# EAGLE design ch552_3key_keyboard (EAGLE 9.6.2)
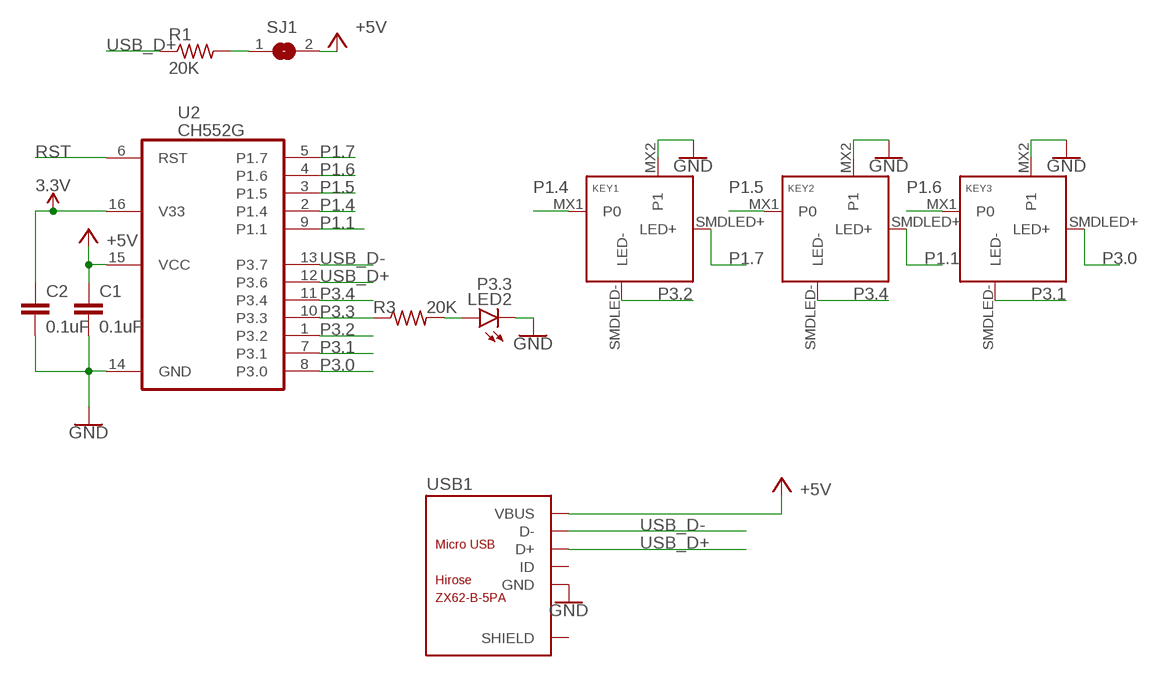
[diagram p0: schematic, sheet 1]

## Parts
C1  0.1uF  C-EUC0805K  [C0805K]
C2  0.1uF  C-EUC0805K  [C0805K]
KEY1  KEYSWITCH-SMDLED-MXHSPCB-1U-SMDLED  [MXHSPCB-1U-SMDLED]
KEY2  KEYSWITCH-SMDLED-MXHSPCB-1U-SMDLED  [MXHSPCB-1U-SMDLED]
KEY3  KEYSWITCH-SMDLED-MXHSPCB-1U-SMDLED  [MXHSPCB-1U-SMDLED]
LED2  P3.3  GHI-BASICCOMPONENTS_LED-(INCH)-0805  [GHI-BASICCOMPONENTS_0805-LED]
R1  20K  R-US_R0805  [R0805]
R3  20K  R-US_R0805  [R0805]
SJ1  SJ  [SJ]
U2  CH552G  MY_IC_CH551G_CH552GSOP-16  [MY_IC_SO16]
USB1  ZX62-B-5PA  MICRO-USB-SMD(ZX62-B-5PA)  [MICRO-USB5+6P-SMD-0.65-AB]

## Nets
3.3V: C2.1 U2.16(V33)
+5V: C1.1 SJ1.2 U2.15(VCC) USB1.1(VBUS)
GND: C1.2 C2.2 KEY1.MX2(P1) KEY2.MX2(P1) KEY3.MX2(P1) LED2.K U2.14(GND) USB1.5(GND)
N$1: R1.2 SJ1.1
N$2: LED2.A R3.2
P1.1: KEY2.SMDLED+(LED+) U2.9(P1.1)
P1.4: KEY1.MX1(P0) U2.2(P1.4)
P1.5: KEY2.MX1(P0) U2.3(P1.5)
P1.6: KEY3.MX1(P0) U2.4(P1.6)
P1.7: KEY1.SMDLED+(LED+) U2.5(P1.7)
P3.0: KEY3.SMDLED+(LED+) U2.8(P3.0)
P3.1: KEY3.SMDLED-(LED-) U2.7(P3.1)
P3.2: KEY1.SMDLED-(LED-) U2.1(P3.2)
P3.3: R3.1 U2.10(P3.3)
P3.4: KEY2.SMDLED-(LED-) U2.11(P3.4)
RST: U2.6(RST)
USB_D+: R1.1 U2.12(P3.6) USB1.3(D+)
USB_D-: U2.13(P3.7) USB1.2(D-)
Unconnected: USB1.4(ID) USB1.P1(SHIELD) USB1.P2(SHIELD) USB1.P3(SHIELD) USB1.P4(SHIELD) USB1.P5(SHIELD) USB1.P6(SHIELD)

## Library data of the parts
C1 C2 = rcl:C-EU: CAPACITOR, European symbol; LCSC: C16834; SPICEPREFIX: C
KEY1-KEY3 = Keyboard:KEYSWITCH-SMDLED
LED2 = BeagleBone_Black_Wireless:GHI-BASICCOMPONENTS_LED-(INCH)-
R1 R3 = rcl:R-US_: RESISTOR, American symbol; SPICEPREFIX: R
SJ1 = jumper:SJ: SMD solder JUMPER
U2 = myOwnLib:MY_IC_CH551G_CH552G; LCSC: C111292
USB1 = microusbConnector:MICRO-USB-SMD(ZX62-B-5PA): 320010005; LCSC: C10418; MPN: ZX62-B-5PA

## Board
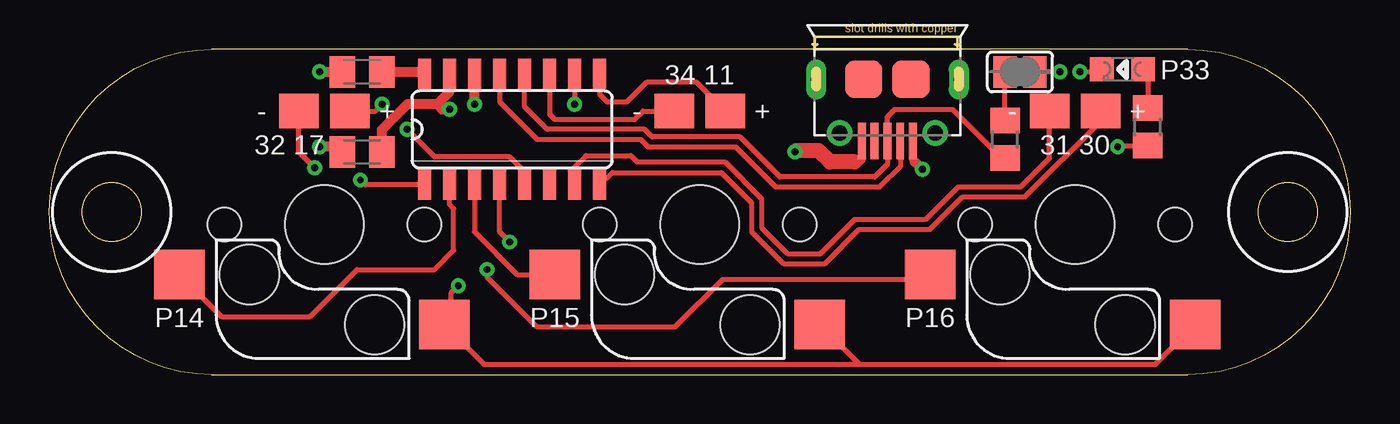
[diagram p1: board, top side]
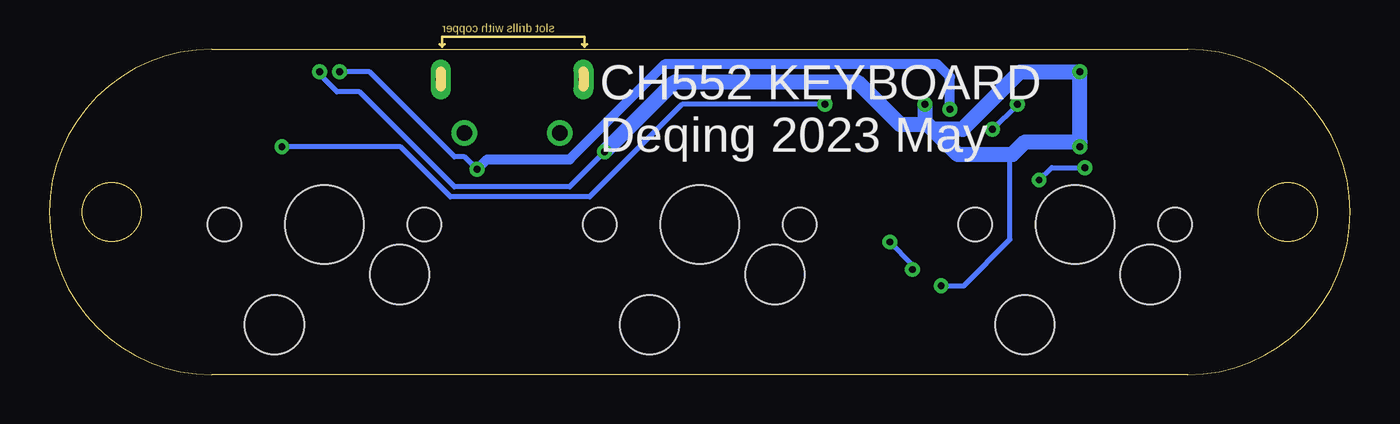
[diagram p2: board, bottom side, seen from below]

Size 66.04 x 16.51 mm. Coordinates in mm from the lower left corner, seen from the top.
Outline: 8.26,0 57.78,0 arc180 57.78,16.51 8.26,16.51 arc180 8.26,0
Outline: circle at 3.17,8.26 radius 1.5
Outline: circle at 62.87,8.26 radius 1.5
Copper layers (1*16): Top 0.035mm / dielectric 1.5mm / Bottom 0.035mm
Design rules "eagleRules10Mil *": minimum track width 10mil, minimum drill 0.3mm, track to track 10mil, track to pad 10mil, pad to pad 10mil, via to via 10mil, smd to smd 10mil, copper to edge 15mil, drill to drill 15mil, minimum pad ring 10mil, minimum via ring 8mil, stop-mask expansion 4mil, vias tented up to drill 14mil, thermal gap 10mil

### Footprints (pad centres in the part's own frame; a part is rotated, then mirrored left to right if it is on the bottom)
C0805K = smd 1.3 x 1.6: 1 -1,0; 2 1,0
MXHSPCB-1U-SMDLED = smd 2.55 x 2.5: MX1 7.36,2.54; MX2 -6.09,5.08 | smd 2 x 1.75: SMDLED+ -1.3,-5.75; SMDLED- 1.3,-5.75 | hole 4: 0,0 | hole 1.7: 5.08,0; -5.08,0 | hole 3: 3.81,2.54; -2.54,5.08
GHI-BASICCOMPONENTS_0805-LED = smd 1.2 x 1.2: A 0,1.05; K 0,-1.05
R0805 = smd 1.3 x 1.5: 1 -0.95,0; 2 0.95,0
SJ = smd 1.168 x 1.6: 1 -0.762,0; 2 0.762,0
MY_IC_SO16 = smd 0.66 x 1.524: 1 -4.445,-2.819; 2 -3.175,-2.819; 3 -1.905,-2.819; 4 -0.635,-2.819; 5 0.635,-2.819; 6 1.905,-2.819; 7 3.175,-2.819; 8 4.445,-2.819; 9 4.445,2.819; 10 3.175,2.819; 11 1.905,2.819; 12 0.635,2.819; 13 -0.635,2.819; 14 -1.905,2.819; 15 -3.175,2.819; 16 -4.445,2.819
MICRO-USB5+6P-SMD-0.65-AB = smd 0.4 x 1.858: 1 -1.3,3.129; 2 -0.65,3.129; 3 0,3.129; 4 0.65,3.129; 5 1.3,3.129 | smd 1.9 x 1.9: P1 -1.2,0; P2 1.2,0 | drill 0.508 pad 1.016 long: P3 -3.625,0; P4 3.625,0 | drill 0.8: P5 -2.425,2.73; P6 2.425,2.73

### Placement (x,y rotation side)
C1  15.88,11.3 180 top
C2  15.88,15.37 180 top
KEY1  13.97,7.62 180 top
KEY2  33.02,7.62 180 top
KEY3  52.07,7.62 180 top
LED2  54.48,15.49 270 top
R1  48.51,11.94 90 top
R3  55.75,12.57 90 top
SJ1  49.28,15.37 0 top
U2  23.5,12.45 0 top
USB1  42.55,14.99 180 top

### Tracks (layer width: path | path; a pad name or v marks a point on that pad's centre or on a via)
3.3V
  Top 0.254: 18.95,15.37 U2.16
  Top 0.508: C2.1 18.95,15.37
+5V  (via drill 0.35)
  Top 0.254: 43.84,10.89 43.94,10.79 | v51.31,15.37 SJ1.2
  Top 0.381: USB1.1 43.84,10.89
  Top 0.508: U2.15 20.32,14.35 19.68,13.72 | C1.1 16.88,12.43 18.16,13.72 19.68,13.72 | 19.68,13.72 19.94,13.46 v20.32,13.46 | 43.94,10.79 v44.32,10.41
  Bottom 0.254: v44.32,10.41 44.96,11.05 45.47,11.05 49.78,15.37 v51.31,15.37
  Bottom 0.508: v20.32,13.46 20.32,15.11 20.95,15.75 34.8,15.75 39.62,10.92 43.81,10.92 v44.32,10.41
GND  (via drill 0.35)
  Top 0.254: C1.2 14.62,11.56 | KEY3.MX2 56.13,0.51 41.14,0.51 | 20.38,2.22 22.09,0.51 41.14,0.51 | 20.38,2.22 KEY1.MX2 | KEY2.MX2 41.14,0.51 | v20.77,4.51 20.38,4.12 20.38,2.22 | v52.32,15.37 53.31,15.37 LED2.K
  Top 0.381: USB1.5 41.24,10.89 41.15,10.79 40.89,10.79
  Top 0.508: 14.62,11.56 v13.72,11.56 | v13.72,15.37 C2.2 | v21.59,13.72 U2.14
  Top 0.762: 40.89,10.79 39.62,10.79 39.05,11.37 37.91,11.37 v37.85,11.3
  Bottom 0.254: 17.14,11.18 17.27,11.05 17.27,6.86 19.62,4.51 v20.77,4.51 | v37.85,11.3 39.62,9.53 45.47,9.53 50.29,14.35 51.44,14.35 51.44,14.36 52.32,15.24 v52.32,15.37
  Bottom 0.762: v13.72,11.56 v13.72,15.37 16.76,15.37 19.68,12.45 21.21,12.45 | v21.59,13.72 21.59,12.83 21.46,12.7 | 21.46,12.7 21.21,12.45 | v37.85,11.3 34.29,14.86 25.02,14.86 22.86,12.7 21.46,12.7 | 21.21,12.45 19.94,11.18 17.14,11.18 16.51,11.81 13.72,11.81
N$1
  Top 0.254: R1.2 SJ1.1
N$2
  Top 0.254: LED2.A 55.75,15.27 R3.2
P1.1
  Top 0.254: U2.9 27.94,14.22 28.32,13.84 29.34,13.84 30.35,14.86 32.64,14.86 32.83,14.86 KEY2.SMDLED+
P1.4
  Top 0.254: KEY1.MX1 8.74,2.94 13.23,2.94 15.62,5.33 19.56,5.33 20.54,6.31 20.54,8.42 20.32,8.64 U2.2
P1.5
  Top 0.254: U2.3 21.59,7.24 23.75,5.08 KEY2.MX1
P1.6  (via drill 0.35)
  Top 0.254: KEY3.MX1 44.46,4.83 34.16,4.83 31.75,2.41 24.77,2.41 22.23,4.95 v22.23,5.33 | v23.37,6.73 22.86,7.24 U2.4
  Bottom 0.254: v22.23,5.33 22.23,5.59 v23.37,6.73
P1.7  (via drill 0.35)
  Top 0.254: U2.5 24.13,10.29 23.37,11.05 19.56,11.05 v18.16,12.45 | KEY1.SMDLED+ 16.56,13.37 v16.9,13.71
  Bottom 0.254: v18.16,12.45 v16.9,13.71
P3.0
  Top 0.254: U2.8 28.57,10.26 34.11,10.26 35.66,8.71 35.66,7.25 37.27,5.63 39.37,5.63 41.1,7.37 44.7,7.37 46.35,9.02 49.53,9.02 53.37,12.86 KEY3.SMDLED+
P3.1
  Top 0.254: U2.7 26.67,10.54 27.24,11.11 29.53,11.11 29.84,10.79 34.29,10.79 36.16,8.92 36.16,7.46 37.48,6.13 39.16,6.13 40.89,7.87 44.49,7.87 46.15,9.53 49.32,9.53 50.77,10.97 KEY3.SMDLED-
P3.2  (via drill 0.35)
  Top 0.254: U2.1 16.05,9.63 v15.79,9.88 | v13.46,10.51 12.67,11.3 KEY1.SMDLED-
  Bottom 0.254: v15.79,9.88 15.17,10.51 v13.46,10.51
P3.3  (via drill 0.35)
  Top 0.254: U2.10 v26.67,13.72 | v54.23,11.56 54.3,11.62 R3.1
  Bottom 0.254: v26.67,13.72 33.91,13.72 38.61,9.02 45.68,9.02 48.22,11.56 v54.23,11.56
P3.4
  Top 0.254: U2.11 25.4,13.21 25.65,12.95 29.72,12.95 30.13,13.37 KEY2.SMDLED-
USB_D+
  Top 0.254: U2.12 24.13,13.59 25.27,12.45 30.23,12.45 30.61,12.06 35.05,12.06 37.08,10.03 41.91,10.03 42.55,10.67 USB1.3 42.55,13.08 42.93,13.46 45.85,13.46 48.32,10.99 R1.1
USB_D-
  Top 0.254: USB1.2 43.2,10.56 42.16,9.53 36.87,9.53 34.84,11.56 30.4,11.56 30.02,11.94 24.77,11.94 22.86,13.84 U2.13

### Text on the board
tPlace: 34 11 | P33 | 32 17 | 31 30 | P14 | P15 | P16
bPlace: CH552 KEYBOARD / Deqing 2023 May